# EAGLE schematic bmsbq (EAGLE 4.13)
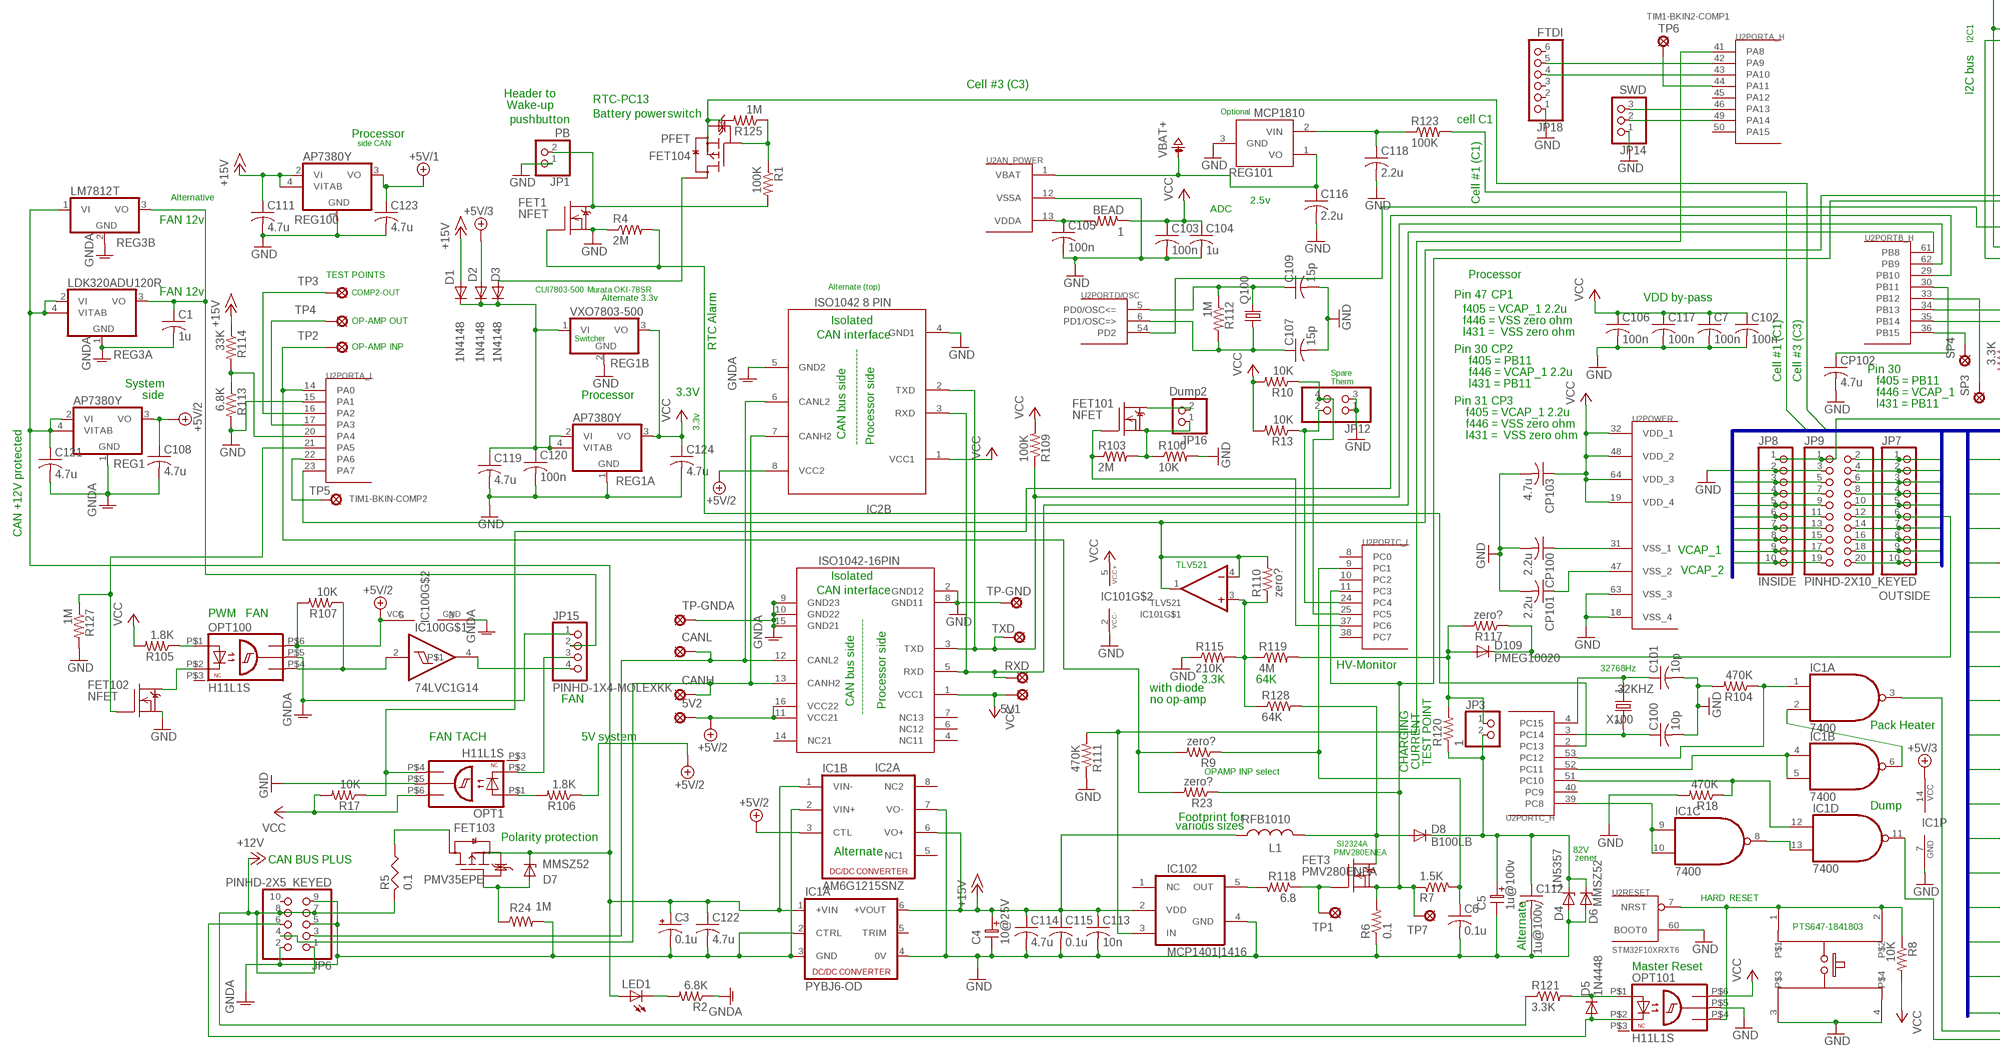
[diagram p0: schematic, sheet 1, part 1 of 2]
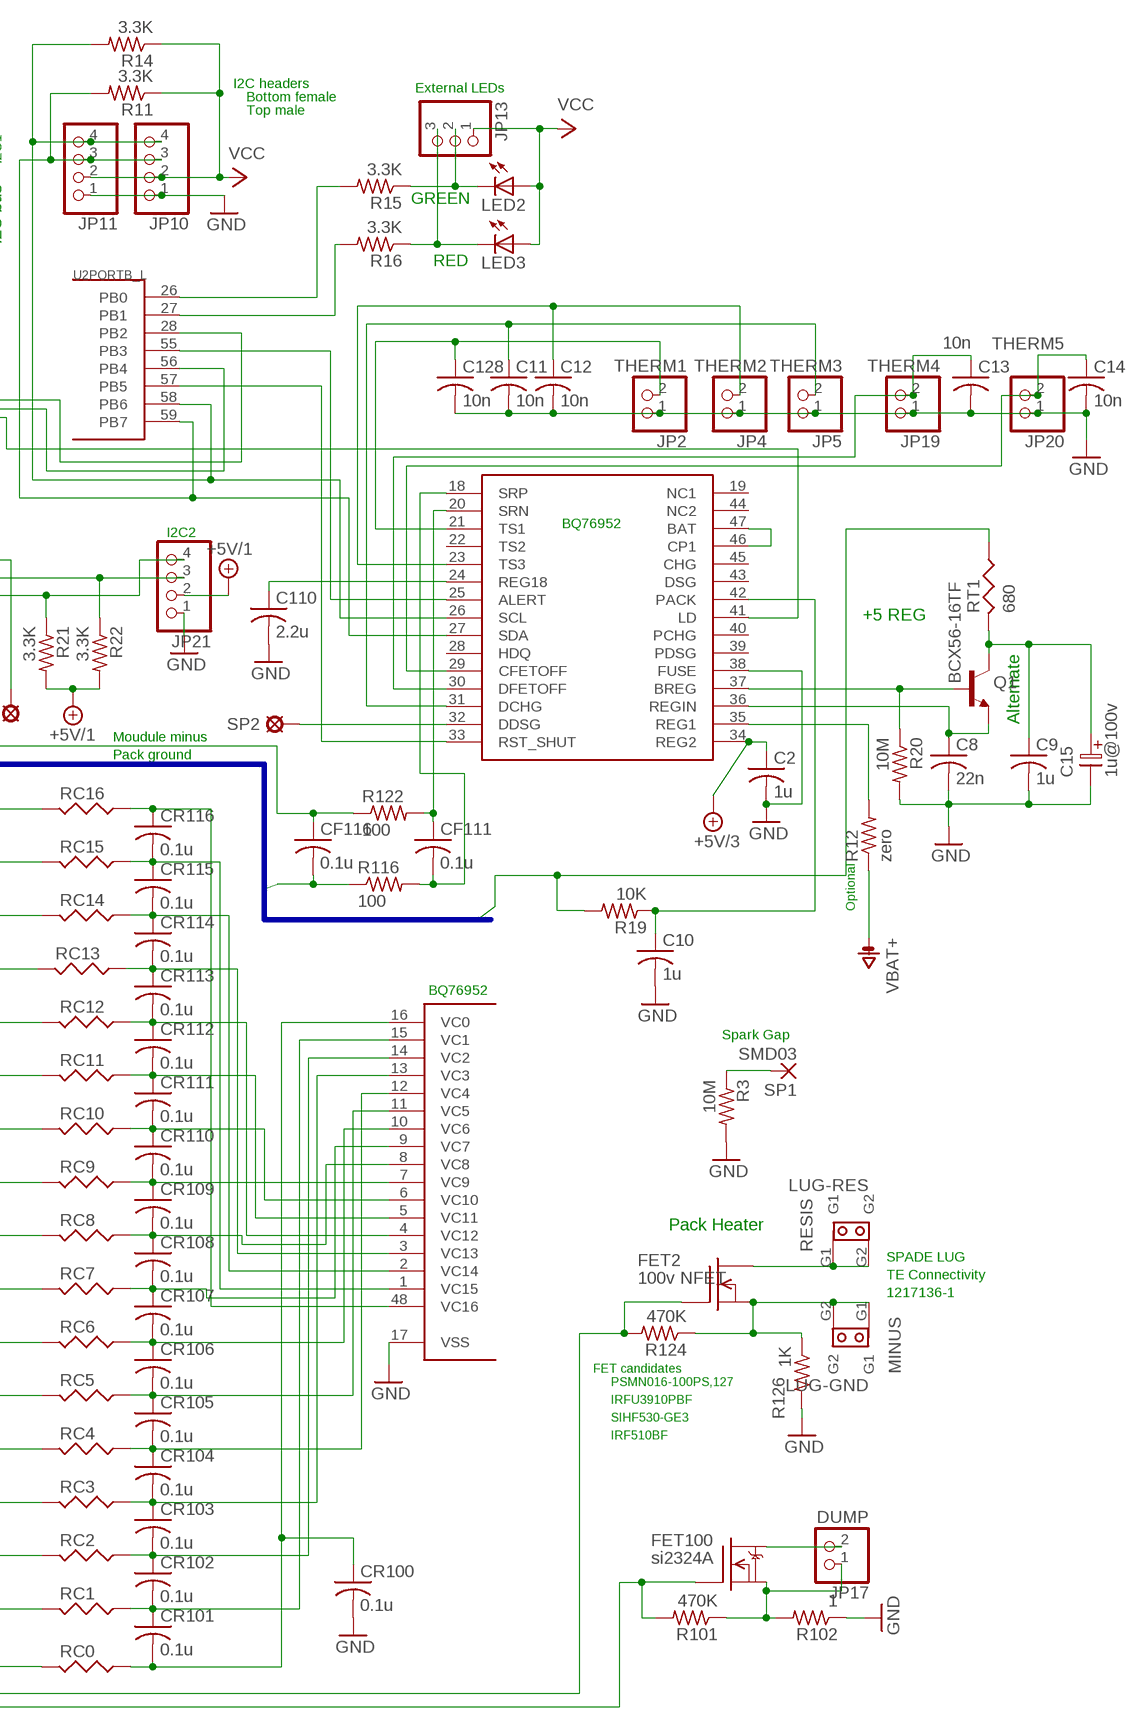
[diagram p1: schematic, sheet 1, part 2 of 2]

## Parts
5V1  SOLDPAD028  [SOLPAD028]
5V2  SOLDPAD028  [SOLPAD028]
32KHZ  X100  XTAL32KX32  [32KHZ]
BEAD  1  R-US_R0603  [R0603]
C1  1u  C-USC0603  [C0603]
C2  1u  C-USC0603  [C0603]
C3  0.1u  CPOL-USE5-8.5  [E5-8,5]
C4  10@25V  ELC-2,5L  [ES-2,5L]
C5  1u@100v  ELC-2,5L  [ES-2,5L]
C6  0.1u  C-USC0603  [C0603]
C7  100n  C-USC0603  [C0603]
C8  22n  C-USC0603  [C0603]
C9  1u  C-USC0603  [C0603]
C10  1u  C-USC0603  [C0603]
C11  10n  C-USC0603  [C0603]
C12  10n  C-USC0603  [C0603]
C13  10n  C-USC0603  [C0603]
C14  10n  C-USC0603  [C0603]
C15  1u@100v  ELC-2,5L  [ES-2,5L]
C100  10p  C-USC0603  [C0603]
C101  10p  C-USC0603  [C0603]
C102  100n  C-USC0603  [C0603]
C103  100n  C-USC0603  [C0603]
C104  1u  C-USC0603  [C0603]
C105  100n  C-USC0603  [C0603]
C106  100n  C-USC0603  [C0603]
C107  15p  C-USC0603  [C0603]
C108  4.7u  C-USC0603  [C0603]
C109  15p  C-USC0603  [C0603]
C110  2.2u  C-USC0603  [C0603]
C111  4.7u  C-USC0603  [C0603]
C112  1u@100v  C-USC1206  [C1206]
C113  10n  C-USC0603  [C0603]
C114  4.7u  C-USC0805  [C0805]
C115  0.1u  C-USC0603  [C0603]
C116  2.2u  C-USC0603  [C0603]
C117  100n  C-USC0603  [C0603]
C118  2.2u  C-USC0603  [C0603]
C119  4.7u  C-USC0603  [C0603]
C120  100n  C-USC0603  [C0603]
C121  4.7u  C-USC0805  [C0805]
C122  4.7u  C-USC0603  [C0603]
C123  4.7u  C-USC0603  [C0603]
C124  4.7u  C-USC0805  [C0805]
C128  10n  C-USC0603  [C0603]
CANH  SOLDPAD028  [SOLPAD028]
CANL  SOLDPAD028  [SOLPAD028]
CF111  0.1u  C-USC0603  [C0603]
CF116  0.1u  C-USC0603  [C0603]
CP100  2.2u  C-USC0603  [C0603]
CP101  2.2u  C-USC0603  [C0603]
CP102  4.7u  C-USC0603  [C0603]
CP103  4.7u  C-USC0603  [C0603]
CR100  0.1u  C-USC0603  [C0603]
CR101  0.1u  C-USC0603  [C0603]
CR102  0.1u  C-USC0603  [C0603]
CR103  0.1u  C-USC0603  [C0603]
CR104  0.1u  C-USC0603  [C0603]
CR105  0.1u  C-USC0603  [C0603]
CR106  0.1u  C-USC0603  [C0603]
CR107  0.1u  C-USC0603  [C0603]
CR108  0.1u  C-USC0603  [C0603]
CR109  0.1u  C-USC0603  [C0603]
CR110  0.1u  C-USC0603  [C0603]
CR111  0.1u  C-USC0603  [C0603]
CR112  0.1u  C-USC0603  [C0603]
CR113  0.1u  C-USC0603  [C0603]
CR114  0.1u  C-USC0603  [C0603]
CR115  0.1u  C-USC0603  [C0603]
CR116  0.1u  C-USC0603  [C0603]
D1  1N4148  1N4004_VERT  [DO41-10_VERT]
D2  1N4148  1N4004_VERT  [DO41-10_VERT]
D3  1N4148  1N4004_VERT  [DO41-10_VERT]
D4  1N5357  ZENER-5W-VERT  [ZENER-VERT]
D5  1N4448  DIODE-SOD123  [SOD123]
D6  MMSZ52  ZENER-DIODESOD80C  [SOD80C]
D7  MMSZ52  ZENER-DIODESOD80C  [SOD80C]
D8  B100LB  [SMB_1]
D109  PMEG10020  [SOT23]
FET1  NFET  DMN3404L  [SOT-23]
FET2  100v NFET  RFP30N06  [TO220V]
FET3  PMV280ENEA  DMN3404L  [SOT-23]
FET100  si2324A  DMN3404L  [SOT-23]
FET101  NFET  DMN3404L  [SOT-23]
FET102  NFET  DMN3404L  [SOT-23]
FET103  PMV35EPE  FET-P-SOT23  [SOT-23]
FET104  PFET  FET-P-SOT23  [SOT-23]
IC1  7400  [TSSOP14]
IC1A  PYBJ6-OD  [PYBJ6-OD]
IC1B  AM6G1215SNZ  [DCDC7PINB]
IC2A  ISO1042-16PIN  [SO-16DW]
IC2B  ISO1042 8 PIN  ISO1042  [SO-08]
IC100  74LVC1G14  74LVC1G17  [SOT-23]
IC101  TLV521  MCP6L01  [SOT23-5]
IC102  MCP1401|1416  MCP1416  [SOT23-5]
JP1  PB  PINHD-1X2  [1X02]
JP2  THERM1  PINHD-1X2  [1X02]
JP3  PINHD-1X2  [1X02]
JP4  THERM2  PINHD-1X2  [1X02]
JP5  THERM3  PINHD-1X2  [1X02]
JP6  PINHD-2X5_KEYED  [2X05_KEYED]
JP7  OUTSIDE  PINHD-1X10  [1X10]
JP8  INSIDE  PINHD-1X10  [1X10]
JP9  PINHD-2X10_KEYED  [2X10_KEYED]
JP10  PINHD-1X4  [1X04]
JP11  PINHD-1X4  [1X04]
JP12  PINHD-2X2  [2X02]
JP13  PINHD-1X3  [1X03]
JP14  SWD  PINHD-1X3  [1X03]
JP15  PINHD-1X4-MOLEXKK  [1X4-MOLEXKK]
JP16  Dump2  PINHD-1X2  [1X02]
JP17  DUMP  PINHD-1X2  [1X02]
JP18  FTDI  PINHD-1X6  [1X06]
JP19  THERM4  PINHD-1X2  [1X02]
JP20  THERM5  PINHD-1X2  [1X02]
JP21  PINHD-1X4  [1X04]
L1  RFB1010  [INDUCTOR6.0]
LED1  LEDCHIP-LED0603  [CHIP-LED0603]
LED2  LEDCHIP-LED0603  [CHIP-LED0603]
LED3  LEDCHIP-LED0603  [CHIP-LED0603]
LUG-GND  MINUS  SPADE-TAB  [SPADE_TAB]
LUG-RES  RESIS  SPADE-TAB  [SPADE_TAB]
OPT1  H11L1S  H!!LX  [SMD-6]
OPT100  H11L1S  H!!LX  [SMD-6]
OPT101  H11L1S  H!!LX  [SMD-6]
Q1  BCX56-16TF  BC850SMD  [SOT23-BEC]
Q100  CRYTALHC49S  [HC49/S]
R1  100K  R-US_R0603  [R0603]
R2  6.8K  R-US_R0603  [R0603]
R3  10M  R-US_R0603  [R0603]
R4  2M  R-US_R0603  [R0603]
R5  0.1  RESUS-S2,5  [RS-2,5]
R6  0.1  R-US_M1206  [M1206]
R7  1.5K  R-US_R0603  [R0603]
R8  10K  R-US_R0603  [R0603]
R9  zero?  R-US_R0603  [R0603]
R10  10K  R-US_R0603  [R0603]
R11  3.3K  R-US_R0603  [R0603]
R12  zero  R-US_R0603  [R0603]
R13  10K  R-US_R0603  [R0603]
R14  3.3K  R-US_R0603  [R0603]
R15  3.3K  R-US_R0603  [R0603]
R16  3.3K  R-US_R0603  [R0603]
R17  10K  R-US_R0603  [R0603]
R18  470K  R-US_R0603  [R0603]
R19  10K  R-US_R0603  [R0603]
R20  10M  R-US_R0603  [R0603]
R21  3.3K  R-US_R0603  [R0603]
R22  3.3K  R-US_R0603  [R0603]
R23  zero?  R-US_R0603  [R0603]
R24  1M  R-US_R0603  [R0603]
R100  10K  R-US_R0603  [R0603]
R101  470K  R-US_R0603  [R0603]
R102  1  R-US_R0603  [R0603]
R103  2M  R-US_R0603  [R0603]
R104  470K  R-US_R0603  [R0603]
R105  1.8K  R-US_R0603  [R0603]
R106  1.8K  R-US_R0603  [R0603]
R107  10K  R-US_R0603  [R0603]
R109  100K  R-US_R0603  [R0603]
R110  zero?  R-US_R0603  [R0603]
R111  470K  R-US_R0603  [R0603]
R112  1M  R-US_R0603  [R0603]
R113  6.8K  R-US_R0603  [R0603]
R114  33K  R-US_R0603  [R0603]
R115  210K  R-US_R0603  [R0603]
R116  100  R-US_R0603  [R0603]
R117  zero?  R-US_R0603  [R0603]
R118  6.8  R-US_R0603  [R0603]
R119  4M  R-US_R0603  [R0603]
R120  1  R-US_R0603  [R0603]
R121  3.3K  R-US_R0603  [R0603]
R122  100  R-US_R0603  [R0603]
R123  100K  R-US_R0603  [R0603]
R124  470K  R-US_R0603  [R0603]
R125  1M  R-US_R0603  [R0603]
R126  1K  R-US_R0603  [R0603]
R127  1M  R-US_R0603  [R0603]
R128  64K  R-US_R0603  [R0603]
RC0  RESUS-S2,5  [RS-2,5]
RC1  RESUS-S2,5  [RS-2,5]
RC2  RESUS-S2,5  [RS-2,5]
RC3  RESUS-S2,5  [RS-2,5]
RC4  RESUS-S2,5  [RS-2,5]
RC5  RESUS-S2,5  [RS-2,5]
RC6  RESUS-S2,5  [RS-2,5]
RC7  RESUS-S2,5  [RS-2,5]
RC8  RESUS-S2,5  [RS-2,5]
RC9  RESUS-S2,5  [RS-2,5]
RC10  RESUS-S2,5  [RS-2,5]
RC11  RESUS-S2,5  [RS-2,5]
RC12  RESUS-S2,5  [RS-2,5]
RC13  RESUS-S2,5  [RS-2,5]
RC14  RESUS-S2,5  [RS-2,5]
RC15  RESUS-S2,5  [RS-2,5]
RC16  RESUS-S2,5  [RS-2,5]
REG1  AP7380Y  [SOT89]
REG1A  AP7380Y  [SOT89]
REG1B  VXO7803-500  78  [TO220V]
REG3A  LDK320ADU120R  AP7380Y  [SOT89]
REG3B  LM7812T  78  [TO220V]
REG100  AP7380Y  [SOT89]
REG101  MCP1810  [SOT-23]
RT1  680  RESUS-S2,5  [RS-2,5]
RXD  SOLDPAD028  [SOLPAD028]
SP1  SMD03  [SMD03]
SP2  SOLDPAD0.6MM  [SOLPAD.6MM]
SP3  SOLDPAD028  [SOLPAD028]
SP4  SOLDPAD028  [SOLPAD028]
TP1  SOLDPAD028  [SOLPAD028]
TP2  SOLDPAD0.6MM  [SOLPAD.6MM]
TP3  SOLDPAD0.6MM  [SOLPAD.6MM]
TP4  SOLDPAD0.6MM  [SOLPAD.6MM]
TP5  SOLDPAD0.6MM  [SOLPAD.6MM]
TP6  SOLDPAD0.6MM  [SOLPAD.6MM]
TP7  SOLDPAD028  [SOLPAD028]
TP-GND  SOLDPAD028  [SOLPAD028]
TP-GNDA  SOLDPAD028  [SOLPAD028]
TXD  SOLDPAD028  [SOLPAD028]
U1  BQ76952  [TQFP48]
U2  STM32F10XRXT6  [TQFP64]
U$1  E-SWITCH2  [E-SWITCH2]

## Nets
12V-R: FET103.3(D) R5.1
+5V/1: C123.1 JP21.2 R21.2 R22.2 REG100.3(VO)
+5V/2: 5V2.MP C108.1 IC1B.3(CTL) IC2A.11(VCC21) IC2A.16(VCC22) IC2B.8(VCC2) IC100.5(VCC) OPT100.P$6(VCC) R106.1 R107.2 REG1.3(VO)
+5V/3: C2.1 D2.A IC1.14(P:VCC) U1.34(REG2)
+12V: JP6.1 JP6.7 JP6.8 R5.2 R121.1
+15V: C4.1 C111.1 C113.1 C114.1 C115.1 D1.A IC1A.6(+VOUT) IC1B.6(VO+) IC102.2(VDD) L1.1 R114.1 REG100.2(VI) REG100.4(VITAB)
/PC10: IC1.2(A:I1) IC1.6(B:O)
BA-TS1-THERM1: C128.1 JP2.2 U1.21(TS1)
BAT-CP1: U1.46(CP1) U1.47(BAT)
BATSW-NDRAIN: FET1.3(D) JP1.2 R1.2
BATSW-PGATE: FET104.1(G) R1.1 R125.1
BEGIN-NPN-EMITTER: C8.1 Q1.E U1.36(REGIN)
BIGFET-DRAIN: FET2.2(D) LUG-RES.G1 LUG-RES.G2
BIGFET-GATE: FET2.1(G) IC1.3(A:O) R124.2
BIGFET-SOURCE: FET2.3(S) LUG-GND.G1 LUG-GND.G2 R124.1 R126.1
BQ-CHG-THERM5: C14.1 JP20.2 U1.29(CFETOFF)
BQ-DSG-THEM4: C13.1 JP19.2 U1.30(DFETOFF)
BQ-PACK: C10.1 R19.1 U1.42(PACK)
BQ-TS3-THERM2: C12.1 JP4.2 U1.23(TS3)
BQ_DCHG-THERM3: C11.1 JP5.2 U1.31(DCHG)
BREG-NPN-BASE: Q1.B R20.1 U1.37(BREG)
C0: JP7.2 JP9.4 RC0.2
C1: JP8.7 JP9.13 R123.2 RC1.2
C2: JP8.3 JP9.5 RC2.2
C3: FET104.2(S) JP7.7 JP9.14 R125.2 RC3.2
C4: JP7.3 JP9.6 RC4.2
C5: JP8.8 JP9.15 RC5.2
C6: JP8.4 JP9.7 RC6.2
C7: JP7.8 JP9.16 RC7.2
C8: JP7.4 JP9.8 RC8.2
C9: JP8.9 JP9.17 RC9.2
C10: JP8.5 JP9.9 RC10.2
C11: JP7.9 JP9.18 RC11.2
C12: JP7.5 JP9.10 RC12.2
C13: JP8.10 JP9.19 RC13.2
C14: JP8.6 JP9.11 RC14.2
C15: JP7.10 JP9.20 RC15.2
C16: D109.3(C) JP7.6 JP9.12 R19.2 R117.1 RC16.2 RT1.1
CAN+12PRO: C3.+ C121.1 C122.1 D7.C FET103.2(S) IC1A.1(+VIN) IC1B.1(VIN-) LED1.A REG1.2(VI) REG1.4(VITAB) REG3A.2(VI) REG3A.4(VITAB) REG3B.1(VI)
CANH2: CANH.MP IC2A.13(CANH2) IC2B.7(CANH2) JP6.4
CANL2: CANL.MP IC2A.12(CANL2) IC2B.6(CANL2) JP6.3
CELL1-PFET-DRAIN: D3.A FET104.3(D)
CELL#1-R: C118.1 R123.1 REG101.2(VIN)
CHGR-FET-DRAIN: D8.A FET3.3(D) L1.2 R128.2
CHGR-TEST-V+: D109.1(A) JP3.1 R117.2 R119.2 R120.2
CHGR-V+: C5.1 C112.1 D4.2(C) D6.C D8.C JP3.2 R120.1
CR15: CR115.1 CR116.2 RC15.1 U1.1(VC15)
DDSG: SP2.MP U1.32(DDSG)
DUMP2: FET101.3(D) JP16.2
DUMP2FET-SOURCE: FET101.2(S) JP16.1 R100.1 R103.2
DUMPFET-DRAIN: FET100.3(D) JP17.2
DUMPFET-SOURCE: FET100.2(S) JP17.1 R101.1 R102.2
FAN+12: C1.1 JP15.2 REG3A.3(VO) REG3B.3(VO)
FANPWN: IC100.2(I) OPT100.P$4(OUT) R107.1
FANPWN-INVERT: IC100.4 JP15.4
FANTACH-H11DIODE: JP15.3 OPT1.P$2(C)
FANTACH-RESISTOR: OPT1.P$1(A) R106.2
FET103-GATE: D7.A FET103.1(G) R24.1
GATE-DRV-MCP1416: IC102.5(OUT) R118.2
GHR_FET_GATE: FET3.1(G) R118.1 TP1.MP
GND: C2.2 C4.2 C5.2 C6.2 C7.2 C8.2 C9.2 C10.2 C11.2 C12.2 C13.2 C14.2 C15.2 C100.2 C101.2 C102.2 C103.2 C104.2 C105.2 C106.2 C107.2 C109.2 C110.2 C111.2 C112.2 C113.2 C114.2 C115.2 C116.2 C117.2 C118.2 C119.2 C120.2 C123.2 C124.2 C128.2 CP100.2 CP101.2 CP102.2 CP103.2 CR100.2 D4.1(A) D6.A FET1.2(S) FET102.2(S) IC1.7(P:GND) IC1A.4(0V) IC1B.7(VO-) IC2A.2(GND12) IC2A.8(GND11) IC2B.4(GND1) IC101.2(VCC-) IC102.4(GND) JP1.1 JP2.1 JP4.1 JP5.1 JP8.2 JP9.3 JP10.1 JP11.1 JP12.1 JP12.3 JP14.1 JP18.1 JP19.1 JP20.1 JP21.1 OPT1.P$5(GND) OPT101.P$5(GND) R3.2 R4.1 R6.1 R18.2 R20.2 R100.2 R102.1 R104.2 R111.1 R113.2 R115.1 R126.2 R127.2 REG1A.1(GND) REG1B.2(GND) REG100.1(GND) REG101.3(GND) TP-GND.MP U1.17(VSS) U1.38(FUSE) U2.12(AN_POWER:VSSA) U2.15(PORTA_L:PA1) U2.18(POWER:VSS_4) U2.60(RESET:BOOT0) U2.63(POWER:VSS_3) U$1.3 U$1.4
GNDA: C1.2 C3.- C108.2 C121.2 C122.2 IC1A.2(CTRL) IC1A.3(GND) IC1B.2(VIN+) IC2A.9(GND23) IC2A.10(GND22) IC2A.15(GND21) IC2B.5(GND2) IC100.3(GND) JP6.2 JP6.5 JP6.9 JP15.1 OPT100.P$5(GND) R2.1 R24.2 REG1.1(GND) REG3A.1(GND) REG3B.2(GND) TP-GNDA.MP
H11L-PWM-R: OPT100.P$1(A) R105.1
H11PWM-FETDRV: FET102.3(D) OPT100.P$2(C)
K1: R3.1 SP1.1(P)
LED-EXT-GRN-CATHODE: JP13.2 LED2.C R15.1
LED-EXT-RED-CATHODE: JP13.3 LED3.C R16.1
LED_BUS_PWR: LED1.C R2.2
MASTER-RESET-RESISTOR: D5.C OPT101.P$1(A) R121.2
MASTER-RESET-SYS: D5.A JP6.6 OPT101.P$2(C)
NPN-COLL: C9.1 C15.1 Q1.C RT1.2
NRST: OPT101.P$4(OUT) R8.1 U2.7(RESET:NRST) U$1.1 U$1.2
OPAMP-PLUS: IC101.3(+IN) R110.1 R115.2 R119.1 R128.1
PA0-OP: R9.2 R23.2 TP2.MP U2.14(PORTA_L:PA0)
PA2-COMP2-OUT: TP3.MP U2.16(PORTA_L:PA2)
PA3-OPAMP_INP: TP4.MP U2.17(PORTA_L:PA3)
PA4-15V-OR-DIVIDED-IN4: R113.1 R114.2 U2.20(PORTA_L:PA4)
PA5-FETGATE-FAN-PWM: FET102.1(G) R127.1 U2.21(PORTA_L:PA5)
PA6-T1-BKIN-COMP2: TP5.MP U2.22(PORTA_L:PA6)
PA8-T1C1-MCP1416_DRV: IC102.3(IN) R111.2 U2.41(PORTA_H:PA8)
PA9-USART1-TX: JP18.5 U2.42(PORTA_H:PA9)
PA10-USART1-RX: JP18.4 U2.43(PORTA_H:PA10)
PA13-SWDIO: JP14.3 U2.46(PORTA_H:PA13)
PA14-SWCLK: JP14.2 U2.49(PORTA_H:PA14)
PB0-LED-GRN: R15.2 U2.26(PORTB_L:PB0)
PB1-LED-RED: R16.2 U2.27(PORTB_L:PB1)
PB2-PA7-HV-DIV-COMP1_INP: IC101.1(OUT) IC101.4(-IN) R110.2 U2.23(PORTA_L:PA7) U2.28(PORTB_L:PB2)
PB3-ALERT: U1.25(ALERT) U2.55(PORTB_L:PB3)
PB4-PC3-CURRENT-SENSE: FET3.2(S) R6.2 R7.1 R23.1 TP7.MP U2.11(PORTC_L:PC3) U2.56(PORTB_L:PB4)
PB5-RST_SHUT: U1.33(RST_SHUT) U2.57(PORTB_L:PB5)
PB6-I2C1-SCL: JP10.4 JP11.4 R14.2 U1.26(SCL) U2.58(PORTB_L:PB6)
PB7-I2C2-SDA: JP10.3 JP11.3 R11.2 U1.27(SDA) U2.59(PORTB_L:PB7)
PB8-CAN-RX: IC2A.5(RXD) IC2B.3(RXD) RXD.MP U2.61(PORTB_H:PB8)
PB9-CAN-TX: IC2A.3(TXD) IC2B.2(TXD) R109.1 TXD.MP U2.62(PORTB_H:PB9)
PB10-T2C3-FANTACH-H11L1OUT: OPT1.P$4(OUT) R17.1 U2.29(PORTB_H:PB10)
PB11-I2C2-SDA|VCAP1: CP102.1 U2.30(PORTB_H:PB11)
PB12-SPI2-NSS: SP3.MP U2.33(PORTB_H:PB12)
PB14-I2C2-SDA: JP21.4 R21.1 U2.35(PORTB_H:PB14)
PB-13-I2C2-SCK: JP21.3 R22.1 U2.34(PORTB_H:PB13)
PB-15: SP4.MP U2.36(PORTB_H:PB15)
PC1-CURRENTSENSE-RC: C6.1 R7.2 R9.1 U2.9(PORTC_L:PC1)
PC4: JP12.2 R13.1 U2.24(PORTC_L:PC4)
PC5: JP12.4 R10.1 U2.25(PORTC_L:PC5)
PC6-DUMPFET-GATE: FET101.1(G) R103.1 U2.37(PORTC_L:PC6)
PC8-/DUMP: IC1.9(C:I0) IC1.10(C:I1) U2.39(PORTC_H:PC8)
PC8-DUMP: IC1.8(C:O) IC1.13(D:I1)
PC10&/PC8-DUMP-FET-GATE: FET100.1(G) IC1.11(D:O) R101.2
PC10-DUMP: IC1.12(D:I0) R18.1 U2.51(PORTC_H:PC10)
PC11-/HEATER: IC1.4(B:I0) IC1.5(B:I1) U2.52(PORTC_H:PC11)
PC12-HEATER: IC1.1(A:I0) R104.1 U2.53(PORTC_H:PC12)
PC13-RTC-OUT: FET1.1(G) R4.2 U2.2(PORTC_H:PC13)
PC14_OSC32IN|XTAL: 32KHZ.2 C100.1 U2.3(PORTC_H:PC14)
PC15-32OSC-OUT: 32KHZ.1 C101.1 U2.4(PORTC_H:PC15)
PD0_OSC_IN_XTAL: C109.1 Q100.2 R112.1 U2.5(PORTD/OSC:PD0/OSC<=)
PD1_OSC_OUT: C107.1 Q100.1 R112.2 U2.6(PORTD/OSC:PD1/OSC=>)
PD2-BQ-LD: U1.41(LD) U2.54(PORTD/OSC:PD2)
PGND_SRN_V: CF116.1 JP8.1 JP9.1 R122.1
REG1: R12.2 U1.35(REG1)
REG18: C110.1 U1.24(REG18)
SRN-PIN: CF111.1 R122.2 U1.20(SRN)
SRP: CF116.2 JP7.1 JP9.2 R116.1
TIM1_BKIN2_COMP2: TP6.MP U2.44(PORTA_H:PA11)
V+: C116.1 R12.1 REG101.1(VO) U2.1(AN_POWER:VBAT) ; supply symbol labelled VBAT+
V-ORED: C119.1 C120.1 D1.C D2.C D3.C REG1A.2(VI) REG1A.4(VITAB) REG1B.1(VI)
VC0: CR100.1 CR101.2 RC0.1 U1.16(VC0)
VC1: CR101.1 CR102.2 RC1.1 U1.15(VC1)
VC2: CR102.1 CR103.2 RC2.1 U1.14(VC2)
VC3: CR103.1 CR104.2 RC3.1 U1.13(VC3)
VC4: CR104.1 CR105.2 RC4.1 U1.12(VC4)
VC5: CR105.1 CR106.2 RC5.1 U1.11(VC5)
VC6: CR106.1 CR107.2 RC6.1 U1.10(VC6)
VC7: CR107.1 CR108.2 RC7.1 U1.9(VC7)
VC8: CR108.1 CR109.2 RC8.1 U1.8(VC8)
VC9: CR109.1 CR110.2 RC9.1 U1.7(VC9)
VC10: CR110.1 CR111.2 RC10.1 U1.6(VC10)
VC11: CR111.1 CR112.2 RC11.1 U1.5(VC11)
VC12: CR112.1 CR113.2 RC12.1 U1.4(VC12)
VC13: CR113.1 CR114.2 RC13.1 U1.3(VC13)
VC14: CR114.1 CR115.2 RC14.1 U1.2(VC14)
VC16: CR116.1 RC16.1 U1.48(VC16)
VCC: 5V1.MP BEAD.1 C7.1 C102.1 C103.1 C104.1 C106.1 C117.1 C124.1 CP103.1 IC2A.1(VCC1) IC2B.1(VCC1) IC101.5(VCC+) JP10.2 JP11.2 JP13.1 LED2.A LED3.A OPT1.P$6(VCC) OPT101.P$6(VCC) R8.2 R10.2 R11.1 R13.2 R14.1 R17.2 R105.2 R109.2 REG1A.3(VO) REG1B.3(VO) U2.19(POWER:VDD_4) U2.32(POWER:VDD_1) U2.48(POWER:VDD_2) U2.64(POWER:VDD_3)
VDDA1: BEAD.2 C105.1 U2.13(AN_POWER:VDDA)
VSS_1-VCAP_1: CP100.1 U2.31(POWER:VSS_1)
VSS_3: CP101.1 U2.47(POWER:VSS_2)
WRP-PIN: CF111.2 R116.2 U1.18(SRP)
Unconnected: IC1A.5(TRIM) IC1B.5(NC1) IC1B.8(NC2) IC2A.4(NC11) IC2A.6(NC12) IC2A.7(NC13) IC2A.14(NC21) IC102.1(NC) JP6.10 JP18.2 JP18.3 JP18.6 OPT1.P$3(NC) OPT100.P$3(NC) OPT101.P$3(NC) U1.19(NC1) U1.22(TS2) U1.28(HDQ) U1.39(PDSG) U1.40(PCHG) U1.43(DSG) U1.44(NC2) U1.45(CHG) U2.8(PORTC_L:PC0) U2.10(PORTC_L:PC2) U2.38(PORTC_L:PC7) U2.40(PORTC_H:PC9) U2.45(PORTA_H:PA12) U2.50(PORTA_H:PA15)

## Buses
HDR$:PGND-SRN,SRP,VSS,C[0..16]

## Notes on the sheet
- I2C headers
- External LEDs
- Bottom female
- Top male
- TIM1-BKIN2-COMP1
- I2C1
- GREEN
- Cell #3 (C3)
- Header to | I2C bus
- RTC-PC13
- Wake-up | Optional | RED
- Battery power | switch
- pushbutton | cell C1
- Processor
- side CAN
- Alternative
- 2.5v | Cell #1 (C1)
- ADC
- FAN 12v
- TEST POINTS | Processor | BQ76952
- I2C2
- Alternate (top)
- CUI7803-500 | Murata OKI-78SR
- FAN 12v | COMP2-OUT | Pin 47 | CP1
- Alternate 3.3v | VDD by-pass
- f405 = VCAP_1 2.2u
- OP-AMP OUT | Isolated | f446 = VSS zero ohm
- +5 REG
- Switcher | l431 =  VSS zero ohm
- CAN interface
- OP-AMP INP | RTC Alarm
- Pin 30 | CP2
- f405 = PB11
- Pin 30
- Spare | f446 = VCAP_1 2.2u
- Cell #1 (C1) | Cell #3 (C3)
- Therm | f405 = PB11
- System | l431 = PB11
- side | Processor | 3.3V | f446 = VCAP_1
- Pin 31 | CP3 | l431 = PB11 | Alternate
- 3.3v
- f405 = VCAP_1 2.2u | Moudule minus
- f446 = VSS zero ohm | Pack ground
- CAN bus side | l431 =  VSS zero ohm
- ------------------------ | Processor side
- TIM1-BKIN-COMP2
- Optional
- CAN +12V protected
- VCAP_1
- TLV521
- VCAP_2
- Isolated | BQ76952
- CAN interface
- Spark Gap
- PWM | FAN
- HV-Monitor
- 32768Hz
- 3.3K | 64K
- FAN | with diode
- CAN bus side | no op-amp
- Processor side
- ------------------------
- Pack Heater | Pack Heater
- FAN | TACH | 5V system
- SPADE LUG
- TE Connectivity
- CURRENT | TEST POINT
- CHARGING
- OPAMP INP select | 1217136-1
- Dump
- Footprint for
- FET candidates
- various sizes
- PSMN016-100PS,127
- Polarity protection
- IRFU3910PBF
- SI2324A | 82V
- CAN BUS PLUS | Alternate | PMV280ENEA | SIHF530-GE3
- zener
- IRF510BF
- HARD | RESET
- PTS647-1841803
- Alternate
- Master Reset

## Library data of the parts
5V1 5V2 CANH CANL RXD SP3 SP4 TP1 TP7 TP-GND TP-GNDA TXD = solpad:SOLDPAD028
32KHZ = crystal:XTAL32K
BEAD R1-R4 R6-R24 R100-R107 R109-R128 = rcl:R-US_: RESISTOR, American symbol
C1 C2 C6-C14 C100-C124 C128 CF111 CF116 CP100-CP103 CR100-CR116 = rcl:C-US: CAPACITOR, American symbol
C3 = rcl:CPOL-US: POLARIZED CAPACITOR, American symbol
C4 C5 C15 = DEH:ELC-2,5L
D1-D3 = diode:1N4004_VERT
D4 = DEH:ZENER-5W-VERT
D5 = diode:DIODE-: DIODE
D6 D7 = diode-1:ZENER-DIODE: Z-Diode
D8 = diode-1:B100LB
D109 = diode-1:PMEG10020
FET1 FET3 FET100-FET102 = transistor-fet:DMN3404L
FET2 = transistor-fet:RFP30N06
FET103 FET104 = transistor-fet:FET-P-SOT23
IC1 = 74xx-us:74*00: Quad 2-input NAND gate
IC1A = dc-dc-converter:PYBJ6-OD
IC1B = dc-dc-converter:AM6G1215SNZ
IC2A = texas:ISO1042-16PIN
IC2B = texas:ISO1042
IC100 = 74xx-us:74LVC1G17
IC101 = op-amp:MCP6L01
IC102 = DEH:MCP1416
JP1-JP5 JP16 JP17 JP19 JP20 = pinhead:PINHD-1X2: PIN HEADER
JP6 = pinhead:PINHD-2X5_KEYED
JP7 JP8 = pinhead:PINHD-1X10: PIN HEADER
JP9 = pinhead:PINHD-2X10_KEYED
JP10 JP11 JP21 = pinhead:PINHD-1X4: PIN HEADER
JP12 = pinhead:PINHD-2X2: PIN HEADER
JP13 JP14 = pinhead:PINHD-1X3: PIN HEADER
JP15 = pinhead:PINHD-1X4-MOLEXKK
JP18 = pinhead:PINHD-1X6: PIN HEADER
L1 = DEH:RFB1010
LED1-LED3 = led:LED: LED OSRAM: - CHIPLED LG R971, LG N971, LY N971, LG Q971, LY Q971, LO R971, LY R971 LH N974, LH R974 LS Q976, LO Q976, LY Q976 LO Q996 - Hyper CHIPLED LW Q18S LB Q993, LB Q99A, LB R99A - SideLED LS A670, LO A670, LY A670, LG A670, LP A670 LB A673, LV A673, LT A673, LW A673 LH A674 LY A675 LS A676, LA A676, LO A676, LY A676, LW A676 LS A679, LY A679, LG A679 - Hyper Micro SIDELED® LS Y876, LA Y876, LO Y876, LY Y876 LT Y87S - SmartLED LW L88C, LW L88S LB L89C, LB L89S, LG L890 LS L89K, LO L89K, LY L89K LS L896, LA L896, LO L896, LY L896 - TOPLED LS T670, LO T670, LY T670, LG T670, LP T670 LSG T670, LSP T670, LSY T670, LOP T670, LYG T670 LG T671, LOG T671, LSG T671 LB T673, LV T673, LT T673, LW T673 LH T674 LS T676, LA T676, LO T676, LY T676, LB T676, LH T676, LSB T676, LW T676 LB T67C, LV T67C, LT T67C, LS T67K, LO T67K, LY T67K, LW E67C LS E67B, LA E67B, LO E67B, LY E67B, LB E67C, LV E67C, LT E67C LW T67C LS T679, LY T679, LG T679 LS T770, LO T770, LY T770, LG T770, LP T770 LB T773, LV T773, LT T773, LW T773 LH T774 LS E675, LA E675, LY E675, LS T675 LS T776, LA T776, LO T776, LY T776, LB T776 LHGB T686 LT T68C, LB T68C - Hyper Mini TOPLED® LB M676 - Mini TOPLED Santana® LG M470 LS M47K, LO M47K, LY M47K Source: http://www.osram.convergy.de/
LUG-GND LUG-RES = DEH:SPADE-TAB
OPT1 OPT100 OPT101 = optocoupler:H!!LX
Q1 = transistor-npn:BC850*: NPN Transistor
Q100 = crystal:CRYTAL: CRYSTAL
R5 RC0 RC1-RC16 RT1 = DEH:RESUS-S2,5
REG1 REG1A REG3A REG100 = linear:AP7380Y
REG1B REG3B = linear:78*: Positive VOLTAGE REGULATOR
REG101 = transistor-fet:MCP1810
SP1 = wirepad:SMD03
SP2 TP2-TP6 = solpad:SOLDPAD0.6MM
U1 = stm32:BQ76952
U2 = stm32:STM32F10XRXT6: STM32F101/103 64pin LQFP
U$1 = switch-misc:E-SWITCH2